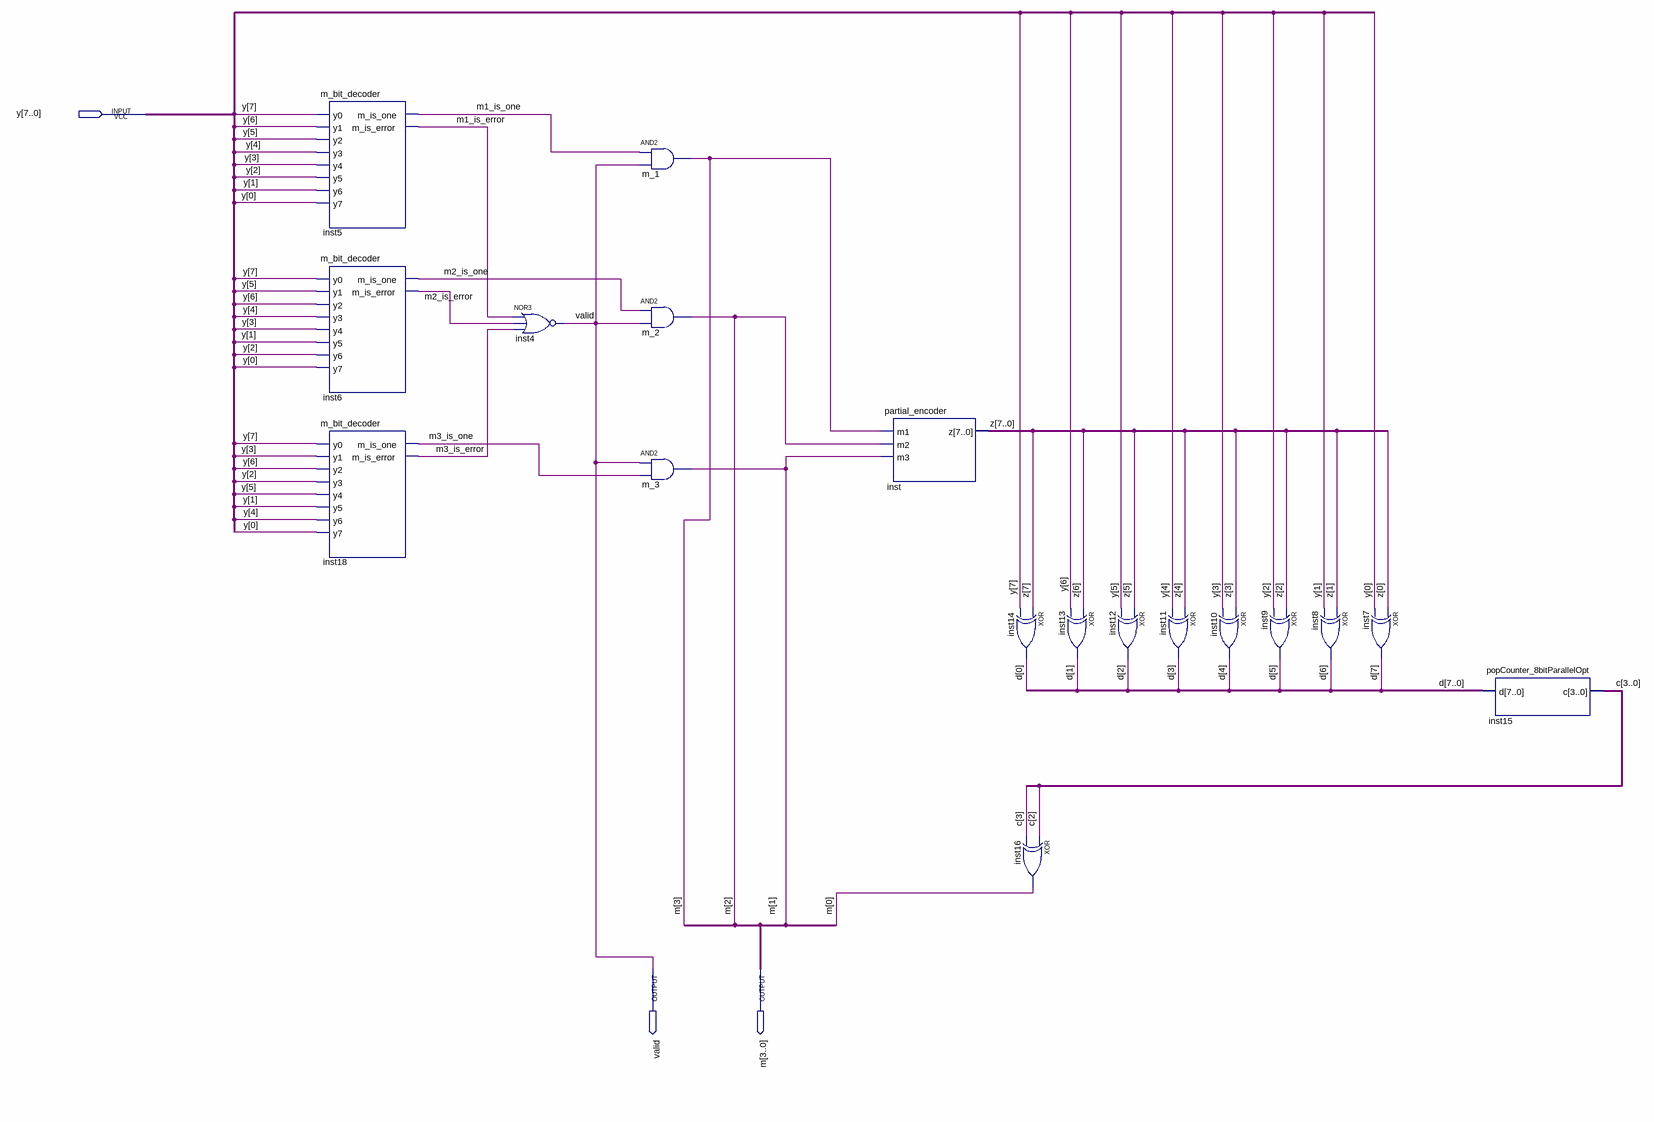
[diagram p0: schematic sheet]
// Quartus schematic full_parallel_decoder.bdf as structural Verilog: 18 symbols, 3 pins
module full_parallel_decoder (
  input  [7:0] y,
  output valid,
  output [3:0] m
);

  wire m1_is_error, m1_is_one, m2_is_error, m2_is_one, m3_is_error, m3_is_one;
  wire [3:0] c;
  wire [7:0] d, z;

  m_bit_decoder inst5 (
    .y0(y[7]), .y1(y[6]), .y2(y[5]), .y3(y[4]), .y4(y[3]), .y5(y[2]), .y6(y[1]), .y7(y[0]),
    .m_is_one(m1_is_one), .m_is_error(m1_is_error));
  m_bit_decoder inst6 (
    .y0(y[7]), .y1(y[5]), .y2(y[6]), .y3(y[4]), .y4(y[3]), .y5(y[1]), .y6(y[2]), .y7(y[0]),
    .m_is_one(m2_is_one), .m_is_error(m2_is_error));
  m_bit_decoder inst18 (
    .y0(y[7]), .y1(y[3]), .y2(y[6]), .y3(y[2]), .y4(y[5]), .y5(y[1]), .y6(y[4]), .y7(y[0]),
    .m_is_one(m3_is_one), .m_is_error(m3_is_error));
  nor inst4 (valid, m1_is_error, m2_is_error, m3_is_error);
  and m_1 (m[3], m1_is_one, valid);
  and m_2 (m[2], m2_is_one, valid);
  and m_3 (m[1], valid, m3_is_one);
  partial_encoder inst (.m1(m[3]), .m2(m[2]), .m3(m[1]), .z(z));
  xor inst14 (d[0], z[7], y[7]);
  xor inst16 (m[0], c[2], c[3]);
  xor inst13 (d[1], z[6], y[6]);
  xor inst12 (d[2], z[5], y[5]);
  xor inst11 (d[3], z[4], y[4]);
  xor inst10 (d[4], z[3], y[3]);
  xor inst9 (d[5], z[2], y[2]);
  xor inst8 (d[6], z[1], y[1]);
  xor inst7 (d[7], z[0], y[0]);
  popCounter_8bitParallelOpt inst15 (.d(d), .c(c));
endmodule
